# EAGLE schematic prototipo_final (EAGLE 8.0.0)

## Sheet 1 of 2
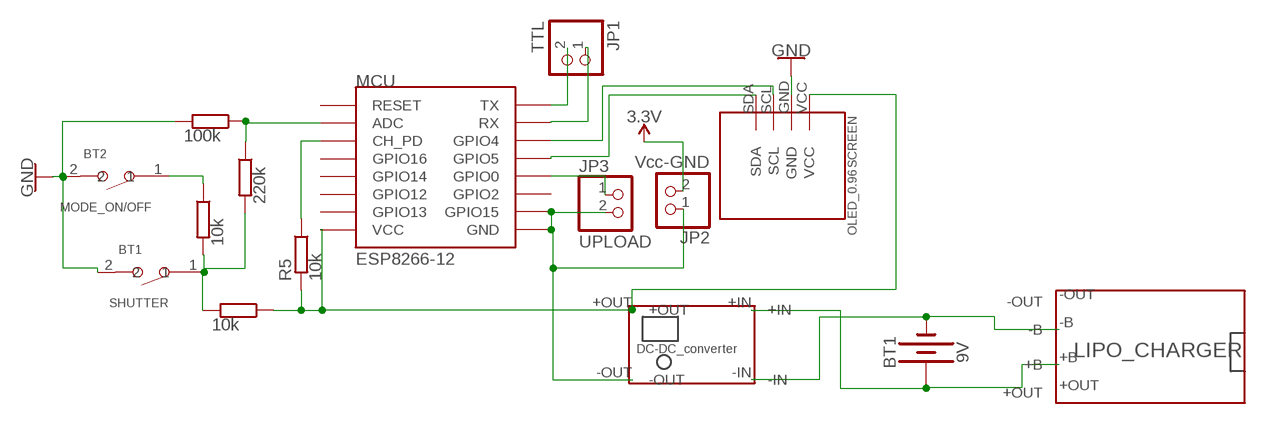
[diagram p0: schematic, sheet 1]

### Parts
BT1  9V  BATTERY-9V  [BATTCON_9V]
JP1  TTL  PINHD-1X2/90  [1X02/90]
JP2  Vcc-GND  PINHD-1X2/90  [1X02/90]
JP3  UPLOAD  PINHD-1X2/90  [1X02/90]
MCU  ESP8266-12  ESP12SMD  [ESP12-SMD]
MODE_ON/OFF  BT2  SMD-BUTTON(2P-3.0X2.5X1.2+0.4MM)-B3U-1000P-2P-SMD  [SW2-2.6-3.0X2.5X1.2+0.4MM]
R1  10k  SMS-0  [SMS-0]
R2  10k  SMS-0  [SMS-0]
R5  10k  SMS-0  [SMS-0]
R6  220k  SMS-0  [SMS-0]
R7  100k  SMS-0  [SMS-0]
SCREEN  OLED_0.96  OLED_0.96_I2C  [OLED_0.96_I2C]
SHUTTER  BT1  SMD-BUTTON(2P-3.0X2.5X1.2+0.4MM)-B3U-1000P-2P-SMD  [SW2-2.6-3.0X2.5X1.2+0.4MM]
U$1  DC-DC_CONVERTER  [DC-DC_CONVERTER]
U$2  LIPO_CHARGER  [LIPO-CHARGER]

### Nets
3.3V: JP2.2
GND: MODE_ON/OFF.2 R7.2 SCREEN.GND SHUTTER.2
N$2: BT1.+ U$1.+IN U$2.+B
N$3: BT1.- U$1.-IN U$2.-B
N$4: MCU.VCC R2.1 R5.2 SCREEN.VCC U$1.+OUT
N$5: JP2.1 JP3.2 MCU.GND MCU.GPIO15 U$1.-OUT
N$6: MCU.ADC R6.1 R7.1
N$7: JP1.2 MCU.TXD0(TX)
N$8: JP1.1 MCU.RXD0(RX)
N$9: MCU.GPIO5 SCREEN.SDA
N$10: MCU.GPIO4 SCREEN.SCL
N$11: R1.2 R2.2 R6.2 SHUTTER.1
N$12: JP3.1 MCU.GPIO0
N$13: MODE_ON/OFF.1 R1.1
N$14: MCU.CH_PD R5.1
Unconnected: MCU.GPIO2 MCU.GPIO12 MCU.GPIO13 MCU.GPIO14 MCU.GPIO16 MCU.RESET U$2.+OUT U$2.-OUT

## Sheet 2 of 2

## Library data of the parts
BT1 = SparkFun-Batteries:BATTERY: Battery - Single Cell A variety of battery chemistries, sizes, and footprints. Device List: 20MM_PTH - Coin Cell Battery Holder - 20mm (PTH) <https://www.sparkfun.com/products/783> 12MM_SMD - Coin Cell Battery Holder - 12mm (SMD) <https://www.sparkfun.com/products/10592> 12MM_PTH - Coin Cell Battery Holder - 12mm (PTH) <https://www.sparkfun.com/products/7948> 20MM_SMD - 20mm Coin Cell Battery Holder (SMD) (2 legs) Used on the Big Time Watch Kit <https://www.sparkfun.com/products/11734> 20MM_SMD_4LEGS - Coin Cell Battery Holder - 20mm (SMD) <https://www.sparkfun.com/products/11892> 20MM_SMD_4LEGS_OVERPASTE - Coin Cell Battery Holder - 20mm (SMD) <https://www.sparkfun.com/products/11892> (Over-paste on the legs) 24.5MM_PTH - Coin Cell Battery Holder - 24.5mm (PTH) <https://www.sparkfun.com/products/8863> 9V - 9V Battery Holder - PC Mount Used on the SparkFun SparkPunk Sound Kit <https://www.sparkfun.com/products/11177> and SparkFun SparkPunk Sequencer Kit <https://www.sparkfun.com/products/12707> 18650 - Battery Holder - 18650 (PTH) <https://www.sparkfun.com/products/13113> AA - Battery Holder - 1xAA (PTH) <https://www.sparkfun.com/products/7949> AAA - Battery Holder - 1xAAA (PTH) <https://www.sparkfun.com/products/12718> AA_KIT - Battery Holder - 1xAA (PTH) <https://www.sparkfun.com/products/7949> Special kit package - pads only have exposed copper on one side of the board. AAA_KIT - Battery Holder - 1xAAA (PTH) <https://www.sparkfun.com/products/12718> Special kit package - pads only have exposed copper on one side of the board.; PROD_ID: BATT-10855
JP1-JP3 = pinhead:PINHD-1X2: PIN HEADER
MCU = esp8266modules:ESP12: ESP8266 Wifi module 12
MODE_ON/OFF SHUTTER = Seeed-Switch-2016:SMD-BUTTON(2P-3.0X2.5X1.2+0.4MM): 311020047; MPN: B3U-1000P-2P-SMD; VALUE: B3U-1000P-2P-SMD
R1 R2 R5-R7 = resistor-shunt:SMS-0: SMD SHUNT RESISTOR
SCREEN = tft_1.8_1.44_oled_0.96:OLED_0.96_I2C
U$1 = PRUEBA_DC:DC-DC_CONVERTER
U$2 = PRUEBA_LIPO_CHARGER:LIPO_CHARGER

## Net classes
0 default: width 0.305 mm, drill 0.508 mm, clearance 0.254 mm